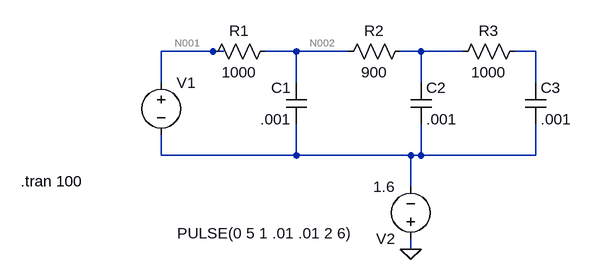
[diagram p0: schematic Draft2.asc]
Draft2.asc, the LTspice schematic file:
Version 4
SHEET 1 880 680
WIRE 128 64 48 64
WIRE 144 64 128 64
WIRE 256 64 208 64
WIRE 336 64 256 64
WIRE 448 64 416 64
WIRE 512 64 448 64
WIRE 624 64 592 64
WIRE 48 112 48 64
WIRE 256 112 256 64
WIRE 448 112 448 64
WIRE 624 112 624 64
WIRE 48 224 48 192
WIRE 256 224 256 176
WIRE 256 224 48 224
WIRE 432 224 256 224
WIRE 448 224 448 176
WIRE 448 224 432 224
WIRE 624 224 624 176
WIRE 624 224 448 224
WIRE 432 272 432 224
WIRE 432 368 432 352
FLAG 432 368 0
SYMBOL voltage 48 96 R0
WINDOW 3 25 248 Left 2
WINDOW 123 0 0 Left 0
WINDOW 39 0 0 Left 0
SYMATTR Value PULSE(0 5 1 .01 .01 2 6)
SYMATTR InstName V1
SYMBOL res 112 80 R270
WINDOW 0 32 56 VTop 2
WINDOW 3 0 56 VBottom 2
SYMATTR InstName R1
SYMATTR Value 1000
SYMBOL cap 272 176 R180
WINDOW 0 24 56 Left 2
WINDOW 3 24 8 Left 2
SYMATTR InstName C1
SYMATTR Value .001
SYMBOL cap 432 112 R0
SYMATTR InstName C2
SYMATTR Value .001
SYMBOL res 432 48 R90
WINDOW 0 0 56 VBottom 2
WINDOW 3 32 56 VTop 2
SYMATTR InstName R2
SYMATTR Value 900
SYMBOL cap 608 112 R0
SYMATTR InstName C3
SYMATTR Value .001
SYMBOL res 608 48 R90
WINDOW 0 0 56 VBottom 2
WINDOW 3 32 56 VTop 2
SYMATTR InstName R3
SYMATTR Value 1000
SYMBOL voltage 432 368 R180
WINDOW 123 0 0 Left 0
WINDOW 39 0 0 Left 0
SYMATTR InstName V2
SYMATTR Value 1.6
TEXT -168 264 Left 2 !.tran 100

The netlist it stands for:
* Draft2.asc
V1 N001 N005 PULSE(0 5 1 .01 .01 2 6)
R1 N001 N002 1000
C1 N005 N002 .001
C2 N003 N005 .001
R2 N003 N002 900
C3 N004 N005 .001
R3 N004 N003 1000
V2 0 N005 1.6
.tran 100
.backanno
.end

* Results of the author's LTspice run, read from the files saved beside the schematic
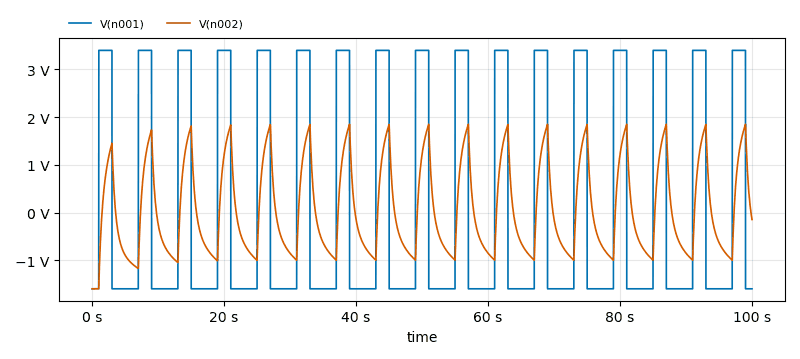
[diagram p1: Transient Analysis of Draft2.asc, plotted from the saved traces]
* Transient Analysis, 1 run:
*   V(n001): min -1.6 V, max 3.4 V, average 108.5 mV, rms 2.371 V, last -1.6 V
*   V(n002): min -1.6 V, max 1.848 V, average 52.55 mV, rms 957.2 mV, last -147.2 mV